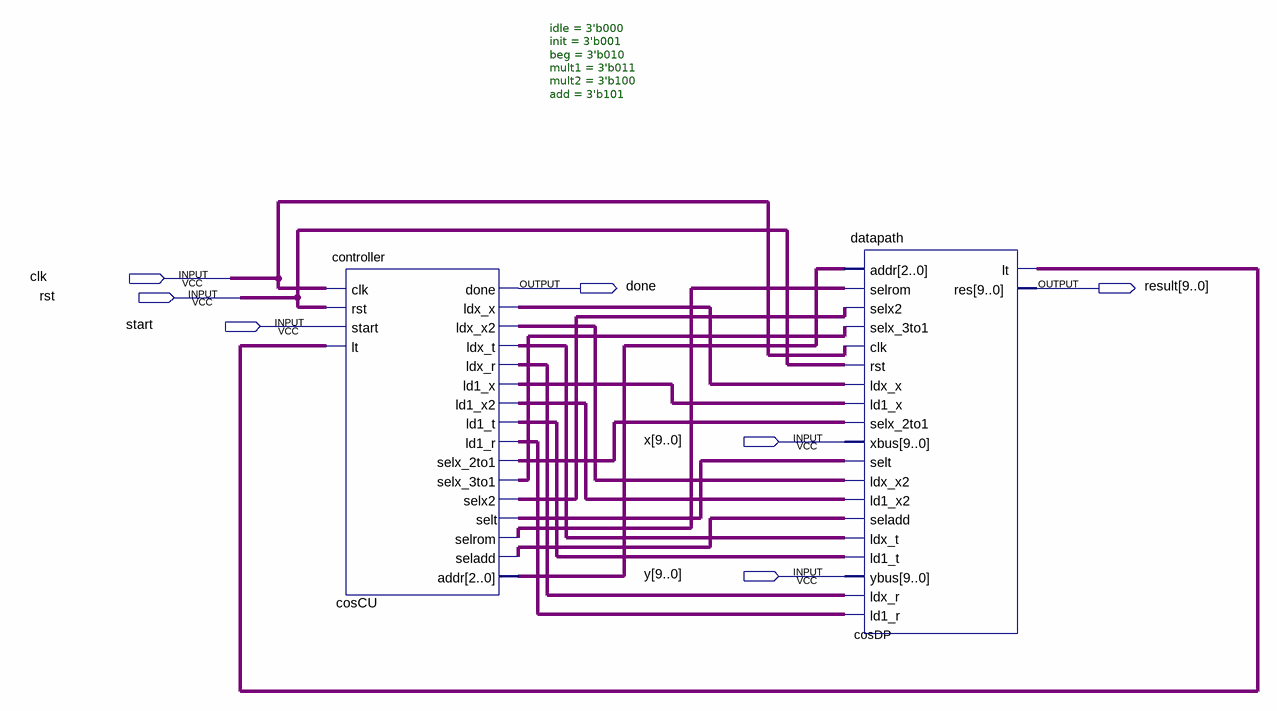
[diagram p0: schematic sheet]
// Quartus schematic cosx.bdf as structural Verilog: 2 symbols, 7 pins
module cosx (
  input  clk,
  input  rst,
  input  start,
  input  [9:0] x,
  input  [9:0] y,
  output done,
  output [9:0] result
);

  wire cosCU_ld1_r, cosCU_ld1_t, cosCU_ld1_x, cosCU_ld1_x2, cosCU_ldx_r, cosCU_ldx_t, cosCU_ldx_x,
       cosCU_ldx_x2, cosCU_seladd, cosCU_selrom, cosCU_selt, cosCU_selx2, cosCU_selx_2to1, cosCU_selx_3to1,
       cosDP_lt;
  wire [2:0] cosCU_addr;

  controller #(.idle(3'b000), .init(3'b001), .beg(3'b010), .mult1(3'b011), .mult2(3'b100), .add(3'b101)) cosCU (
    .clk(clk), .rst(rst), .start(start), .lt(cosDP_lt), .done(done), .ldx_x(cosCU_ldx_x),
    .ldx_x2(cosCU_ldx_x2), .ldx_t(cosCU_ldx_t), .ldx_r(cosCU_ldx_r), .ld1_x(cosCU_ld1_x),
    .ld1_x2(cosCU_ld1_x2), .ld1_t(cosCU_ld1_t), .ld1_r(cosCU_ld1_r), .selx_2to1(cosCU_selx_2to1),
    .selx_3to1(cosCU_selx_3to1), .selx2(cosCU_selx2), .selt(cosCU_selt), .selrom(cosCU_selrom),
    .seladd(cosCU_seladd), .addr(cosCU_addr));
  datapath cosDP (
    .addr(cosCU_addr), .selrom(cosCU_selrom), .selx2(cosCU_selx2), .selx_3to1(cosCU_selx_3to1), .clk(clk),
    .rst(rst), .ldx_x(cosCU_ldx_x), .ld1_x(cosCU_ld1_x), .selx_2to1(cosCU_selx_2to1), .xbus(x),
    .selt(cosCU_selt), .ldx_x2(cosCU_ldx_x2), .ld1_x2(cosCU_ld1_x2), .seladd(cosCU_seladd),
    .ldx_t(cosCU_ldx_t), .ld1_t(cosCU_ld1_t), .ybus(y), .ldx_r(cosCU_ldx_r), .ld1_r(cosCU_ld1_r),
    .lt(cosDP_lt), .res(result));
endmodule
